# EAGLE design cicely_B_v1 (EAGLE 9.6.2)

## Sheet 1 of 4: Power
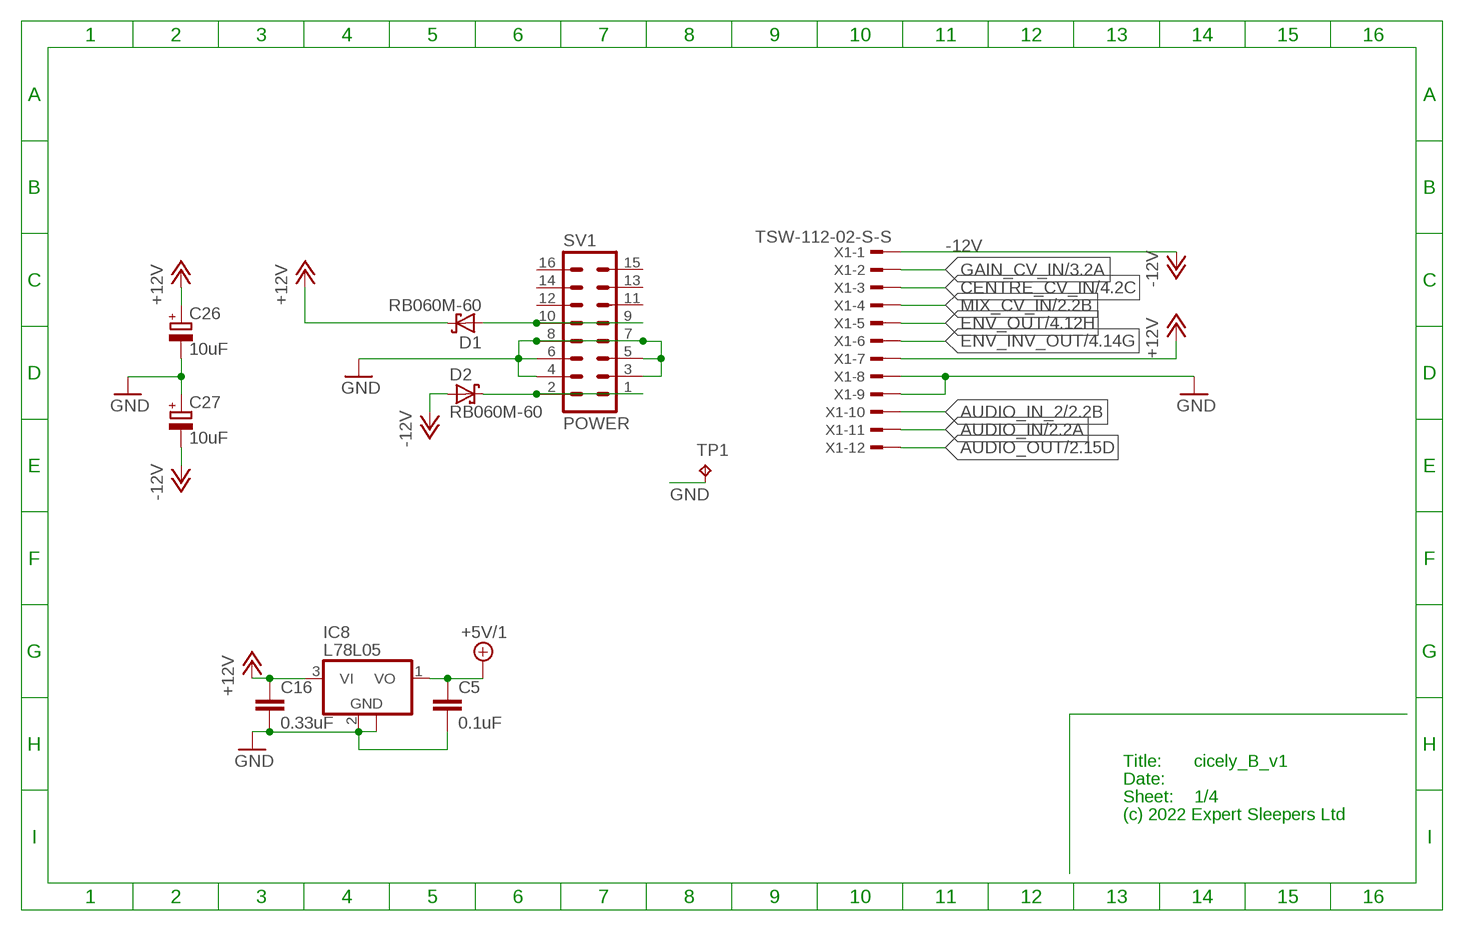
[diagram p0: schematic, sheet 1]

### Parts
C5  0.1uF  C-EUC0402  [C0402]
C16  0.33uF  C-EUC0805  [C0805]
C26  10uF  CPOL-EUUD-4X5,8  [UD-4X5,8_NICHICON]
C27  10uF  CPOL-EUUD-4X5,8  [UD-4X5,8_NICHICON]
D1  RB060M-60  [SOD123FL]
D2  RB060M-60  [SOD123FL]
IC8  L78L05  78L05F  [SOT89]
SV1  POWER  ML16  [ML16]
TP1  RA2  TPPAD1-13  [P1-13]
X1  TSW-112-02-S-S  [TSW-112-02-S-S]

### Nets
+5V/1: C5.1 IC8.1(VO) ; also sheet 2,3
+12V: C16.1 C26.+ D1.C IC8.3(VI) X1.7 ; also sheet 2,3,4
-12V: C27.- D2.A X1.1 ; also sheet 2,3,4
AUDIO_IN: X1.11 ; also sheet 2
AUDIO_IN_2: X1.10 ; also sheet 2
AUDIO_OUT: X1.12 ; also sheet 2
CENTRE_CV_IN: X1.3 ; also sheet 4
ENV_INV_OUT: X1.6 ; also sheet 4
ENV_OUT: X1.5 ; also sheet 4
GAIN_CV_IN: X1.2 ; also sheet 3
GND [power]: C5.2 C16.2 C26.- C27.+ IC8.2(GND) IC8.2@1(GND) SV1.3 SV1.4 SV1.5 SV1.6 SV1.7 SV1.8 TP1.TP X1.8 X1.9 ; also sheet 2,3,4
MIX_CV_IN: X1.4 ; also sheet 2
N$1: D2.C SV1.1 SV1.2
N$15: D1.A SV1.9 SV1.10
Unconnected: SV1.11 SV1.12 SV1.13 SV1.14 SV1.15 SV1.16

### Notes on the sheet
- Title:
- Date:
- Sheet:
- (c) 2022 Expert Sleepers Ltd

## Sheet 2 of 4: Mixer
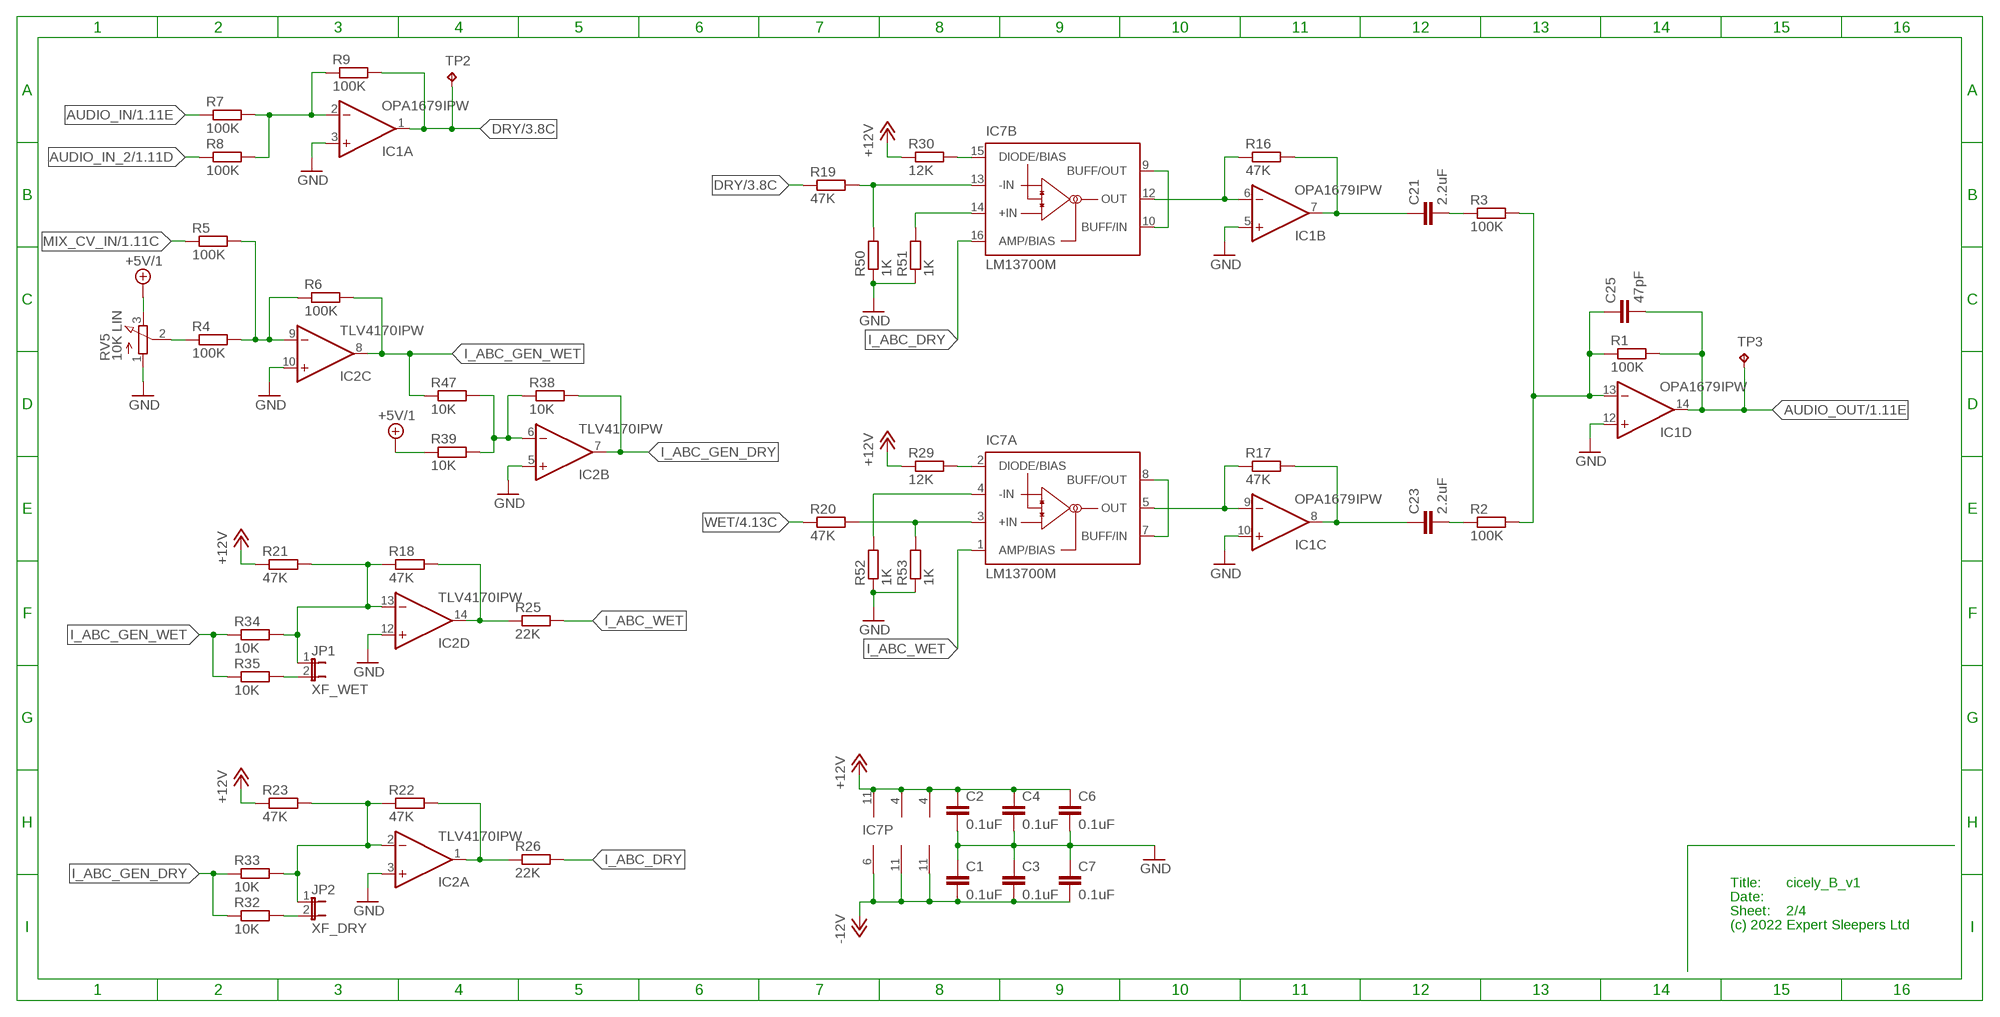
[diagram p1: schematic, sheet 2]

### Parts
C1  0.1uF  C-EUC0402  [C0402]
C2  0.1uF  C-EUC0402  [C0402]
C3  0.1uF  C-EUC0402  [C0402]
C4  0.1uF  C-EUC0402  [C0402]
C6  0.1uF  C-EUC0402  [C0402]
C7  0.1uF  C-EUC0402  [C0402]
C21  2.2uF  C-EUC0805  [C0805]
C23  2.2uF  C-EUC0805  [C0805]
C25  47pF  C-EUC0603  [C0603]
IC1  OPA1679IPW  TL074PW  [PW_R-PDSO-G14]
IC2  TLV4170IPW  TL074PW  [PW_R-PDSO-G14]
IC7  LM13700M  [SO16]
JP1  XF_WET  JP1E  [JP1]
JP2  XF_DRY  JP1E  [JP1]
R1  100K  R-EU_R0603  [R0603]
R2  100K  R-EU_R0603  [R0603]
R3  100K  R-EU_R0603  [R0603]
R4  100K  R-EU_R0603  [R0603]
R5  100K  R-EU_R0603  [R0603]
R6  100K  R-EU_R0603  [R0603]
R7  100K  R-EU_R0603  [R0603]
R8  100K  R-EU_R0603  [R0603]
R9  100K  R-EU_R0603  [R0603]
R16  47K  R-EU_R0603  [R0603]
R17  47K  R-EU_R0603  [R0603]
R18  47K  R-EU_R0603  [R0603]
R19  47K  R-EU_R0603  [R0603]
R20  47K  R-EU_R0603  [R0603]
R21  47K  R-EU_R0603  [R0603]
R22  47K  R-EU_R0603  [R0603]
R23  47K  R-EU_R0603  [R0603]
R25  22K  R-EU_R0603  [R0603]
R26  22K  R-EU_R0603  [R0603]
R29  12K  R-EU_R0603  [R0603]
R30  12K  R-EU_R0603  [R0603]
R32  10K  R-EU_R0603  [R0603]
R33  10K  R-EU_R0603  [R0603]
R34  10K  R-EU_R0603  [R0603]
R35  10K  R-EU_R0603  [R0603]
R38  10K  R-EU_R0603  [R0603]
R39  10K  R-EU_R0603  [R0603]
R47  10K  R-EU_R0603  [R0603]
R50  1K  R-EU_R0603  [R0603]
R51  1K  R-EU_R0603  [R0603]
R52  1K  R-EU_R0603  [R0603]
R53  1K  R-EU_R0603  [R0603]
RV5  10K LIN  RD1610NOA0X  [RD1610NOA0X]
TP2  RA2  TPPAD1-13  [P1-13]
TP3  RA2  TPPAD1-13  [P1-13]

### Nets
+5V/1: R39.1 RV5.3(E) ; also sheet 1,3
+12V: C2.1 C4.1 C6.1 IC1.4(P:V+) IC2.4(P:V+) IC7.11(P:V+) R21.1 R23.1 R29.1 R30.1 ; also sheet 1,3,4
-12V: C1.2 C3.2 C7.2 IC1.11(P:V-) IC2.11(P:V-) IC7.6(P:V-) ; also sheet 1,3,4
AUDIO_IN: R7.1 ; also sheet 1
AUDIO_IN_2: R8.1 ; also sheet 1
AUDIO_OUT: C25.2 IC1.14(D:OUT) R1.2 TP3.TP ; also sheet 1
DRY: IC1.1(A:OUT) R9.2 R19.1 TP2.TP ; also sheet 3,4
GND [power]: C1.1 C2.2 C3.1 C4.2 C6.2 C7.1 IC1.3(A:+IN) IC1.5(B:+IN) IC1.10(C:+IN) IC1.12(D:+IN) IC2.3(A:+IN) IC2.5(B:+IN) IC2.10(C:+IN) IC2.12(D:+IN) R50.1 R51.1 R52.1 R53.1 RV5.1(A) ; also sheet 1,3,4
I_ABC_DRY: IC7.16(B:AMP/BIAS) R26.2
I_ABC_GEN_DRY: IC2.7(B:OUT) R32.1 R33.1 R38.2
I_ABC_GEN_WET: IC2.8(C:OUT) R6.2 R34.1 R35.1 R47.1
I_ABC_WET: IC7.1(A:AMP/BIAS) R25.2
MIX_CV_IN: R5.1 ; also sheet 1
N$2: C25.1 IC1.13(D:-IN) R1.1 R2.2 R3.2
N$7: R4.1 RV5.2(S)
N$9: IC7.15(B:DIODE/BIAS) R30.2
N$10: IC1.9(C:-IN) IC7.5(A:OUT) R17.1
N$12: IC7.2(A:DIODE/BIAS) R29.2
N$13: IC1.6(B:-IN) IC7.12(B:OUT) R16.1
N$14: C23.1 IC1.8(C:OUT) R17.2
N$18: IC2.9(C:-IN) R4.2 R5.2 R6.1
N$20: C21.1 IC1.7(B:OUT) R16.2
N$23: IC7.3(A:+IN) R20.2 R53.2
N$24: IC7.4(A:-IN) R52.2
N$26: IC2.13(D:-IN) JP1.1 R18.1 R21.2 R34.2
N$27: IC2.6(B:-IN) R38.1 R39.2 R47.2
N$28: IC2.14(D:OUT) R18.2 R25.1
N$31: IC2.1(A:OUT) R22.2 R26.1
N$32: IC2.2(A:-IN) JP2.1 R22.1 R23.2 R33.2
N$33: IC7.14(B:+IN) R51.2
N$34: IC7.13(B:-IN) R19.2 R50.2
N$36: C21.2 R3.1
N$38: C23.2 R2.1
N$39: IC7.9(B:BUFF/OUT) IC7.10(B:BUFF/IN)
N$43: IC7.7(A:BUFF/IN) IC7.8(A:BUFF/OUT)
N$44: IC1.2(A:-IN) R7.2 R8.2 R9.1
N$68: JP2.2 R32.2
N$77: JP1.2 R35.2
WET: R20.1 ; also sheet 4

### Notes on the sheet
- Title:
- Date:
- Sheet:
- (c) 2022 Expert Sleepers Ltd

## Sheet 3 of 4: Gain
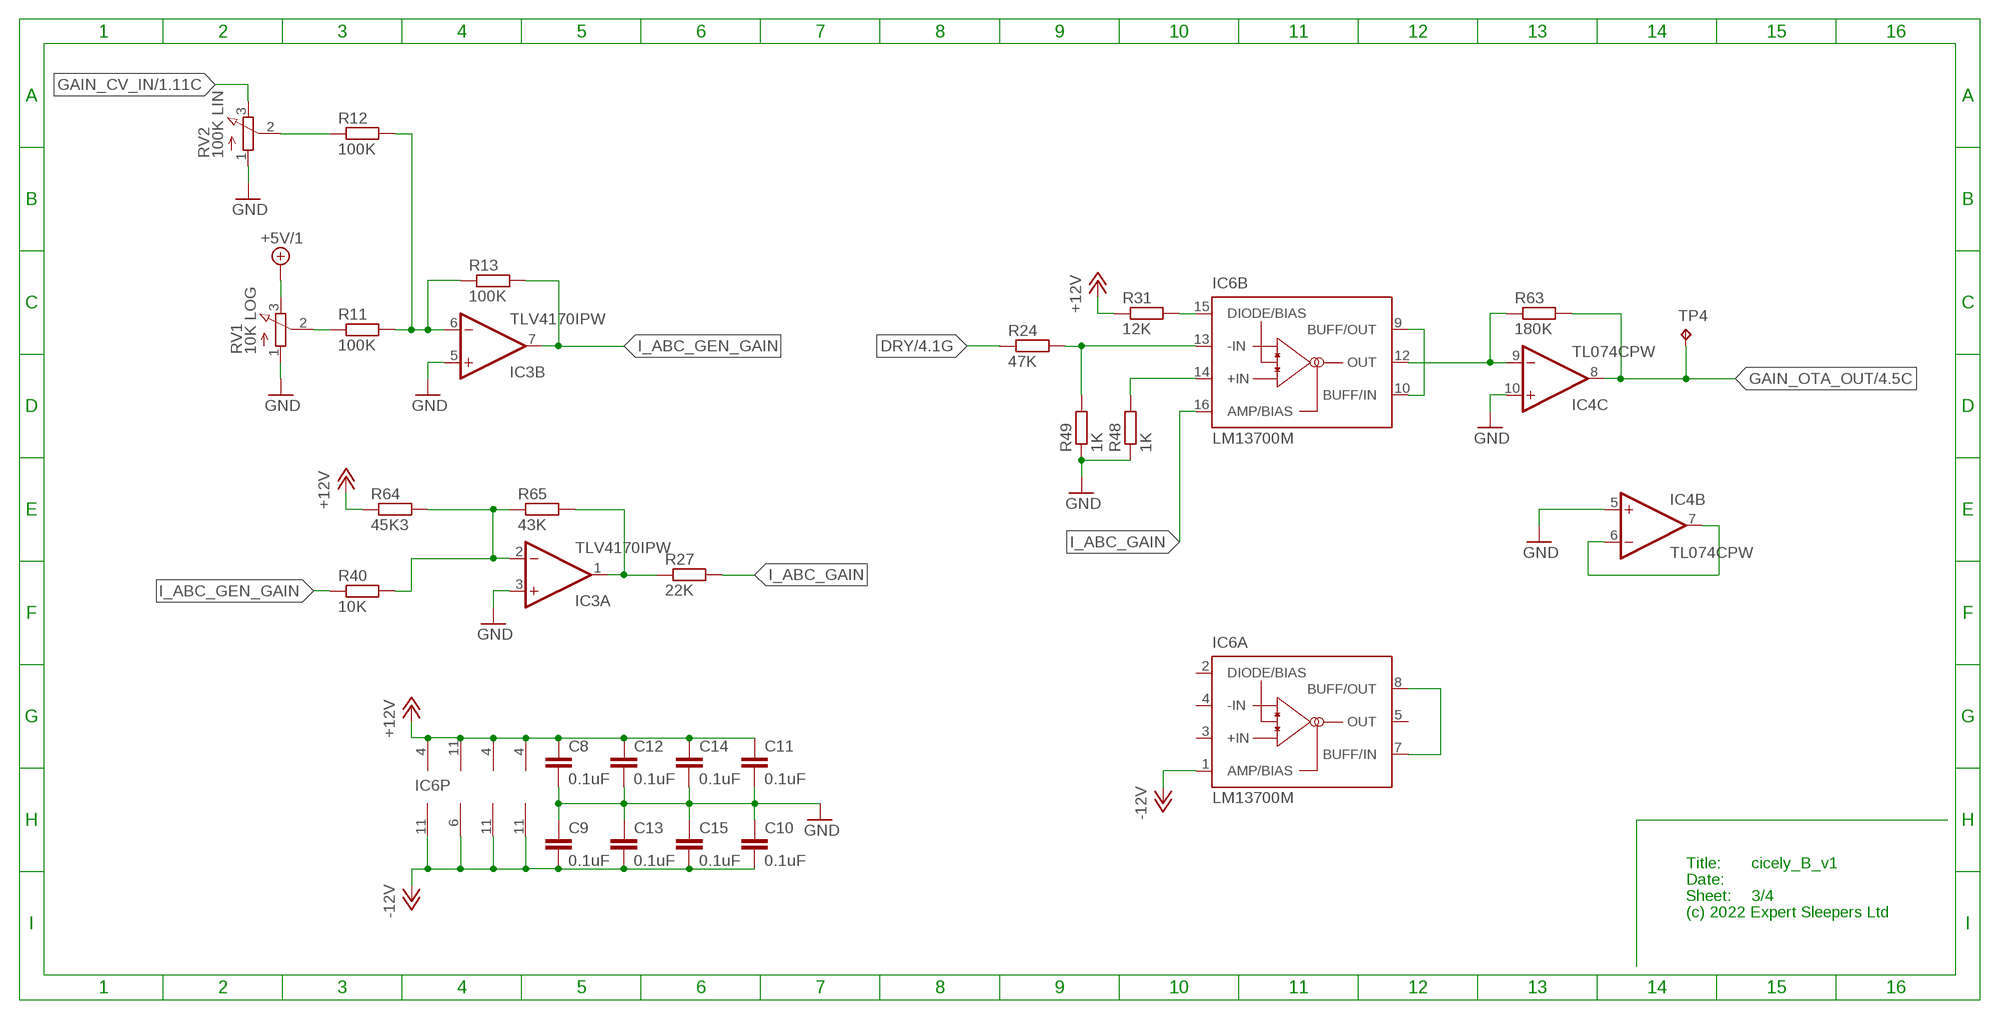
[diagram p2: schematic, sheet 3]

### Parts
C8  0.1uF  C-EUC0402  [C0402]
C9  0.1uF  C-EUC0402  [C0402]
C10  0.1uF  C-EUC0402  [C0402]
C11  0.1uF  C-EUC0402  [C0402]
C12  0.1uF  C-EUC0402  [C0402]
C13  0.1uF  C-EUC0402  [C0402]
C14  0.1uF  C-EUC0402  [C0402]
C15  0.1uF  C-EUC0402  [C0402]
IC3  TLV4170IPW  TL074PW  [PW_R-PDSO-G14]
IC4  TL074CPW  TL074PW  [PW_R-PDSO-G14]
IC5  TL074CPW  TL074PW  [PW_R-PDSO-G14]
IC6  LM13700M  [SO16]
R11  100K  R-EU_R0603  [R0603]
R12  100K  R-EU_R0603  [R0603]
R13  100K  R-EU_R0603  [R0603]
R24  47K  R-EU_R0603  [R0603]
R27  22K  R-EU_R0603  [R0603]
R31  12K  R-EU_R0603  [R0603]
R40  10K  R-EU_R0603  [R0603]
R48  1K  R-EU_R0603  [R0603]
R49  1K  R-EU_R0603  [R0603]
R63  180K  R-EU_R0603  [R0603]
R64  45K3  R-EU_R0603  [R0603]
R65  43K  R-EU_R0603  [R0603]
RV1  10K LOG  RD1610NOA0X  [RD1610NOA0X]
RV2  100K LIN  RD1610NOA0X  [RD1610NOA0X]
TP4  RA2  TPPAD1-13  [P1-13]

### Nets
+5V/1: RV1.3(E) ; also sheet 1,2
+12V: C8.1 C11.1 C12.1 C14.1 IC3.4(P:V+) IC4.4(P:V+) IC5.4(P:V+) IC6.11(P:V+) R31.1 R64.1 ; also sheet 1,2,4
-12V: C9.2 C10.2 C13.2 C15.2 IC3.11(P:V-) IC4.11(P:V-) IC5.11(P:V-) IC6.1(A:AMP/BIAS) IC6.6(P:V-) ; also sheet 1,2,4
DRY: R24.1 ; also sheet 2,4
GAIN_CV_IN: RV2.3(E) ; also sheet 1
GAIN_OTA_OUT: IC4.8(C:OUT) R63.2 TP4.TP ; also sheet 4
GND [power]: C8.2 C9.1 C10.1 C11.2 C12.2 C13.1 C14.2 C15.1 IC3.3(A:+IN) IC3.5(B:+IN) IC4.5(B:+IN) IC4.10(C:+IN) R48.1 R49.1 RV1.1(A) RV2.1(A) ; also sheet 1,2,4
I_ABC_GAIN: IC6.16(B:AMP/BIAS) R27.2
I_ABC_GEN_GAIN: IC3.7(B:OUT) R13.2 R40.1
N$8: IC6.9(B:BUFF/OUT) IC6.10(B:BUFF/IN)
N$35: IC6.7(A:BUFF/IN) IC6.8(A:BUFF/OUT)
N$37: IC6.15(B:DIODE/BIAS) R31.2
N$40: IC4.9(C:-IN) IC6.12(B:OUT) R63.1
N$41: IC4.6(B:-IN) IC4.7(B:OUT)
N$46: IC6.14(B:+IN) R48.2
N$48: IC6.13(B:-IN) R24.2 R49.2
N$50: R11.1 RV1.2(S)
N$51: IC3.6(B:-IN) R11.2 R12.2 R13.1
N$52: IC3.2(A:-IN) R40.2 R64.2 R65.1
N$53: IC3.1(A:OUT) R27.1 R65.2
N$87: R12.1 RV2.2(S)
Unconnected: IC6.2(A:DIODE/BIAS) IC6.3(A:+IN) IC6.4(A:-IN) IC6.5(A:OUT)

### Notes on the sheet
- Title:
- Date:
- Sheet:
- (c) 2022 Expert Sleepers Ltd

## Sheet 4 of 4: Core
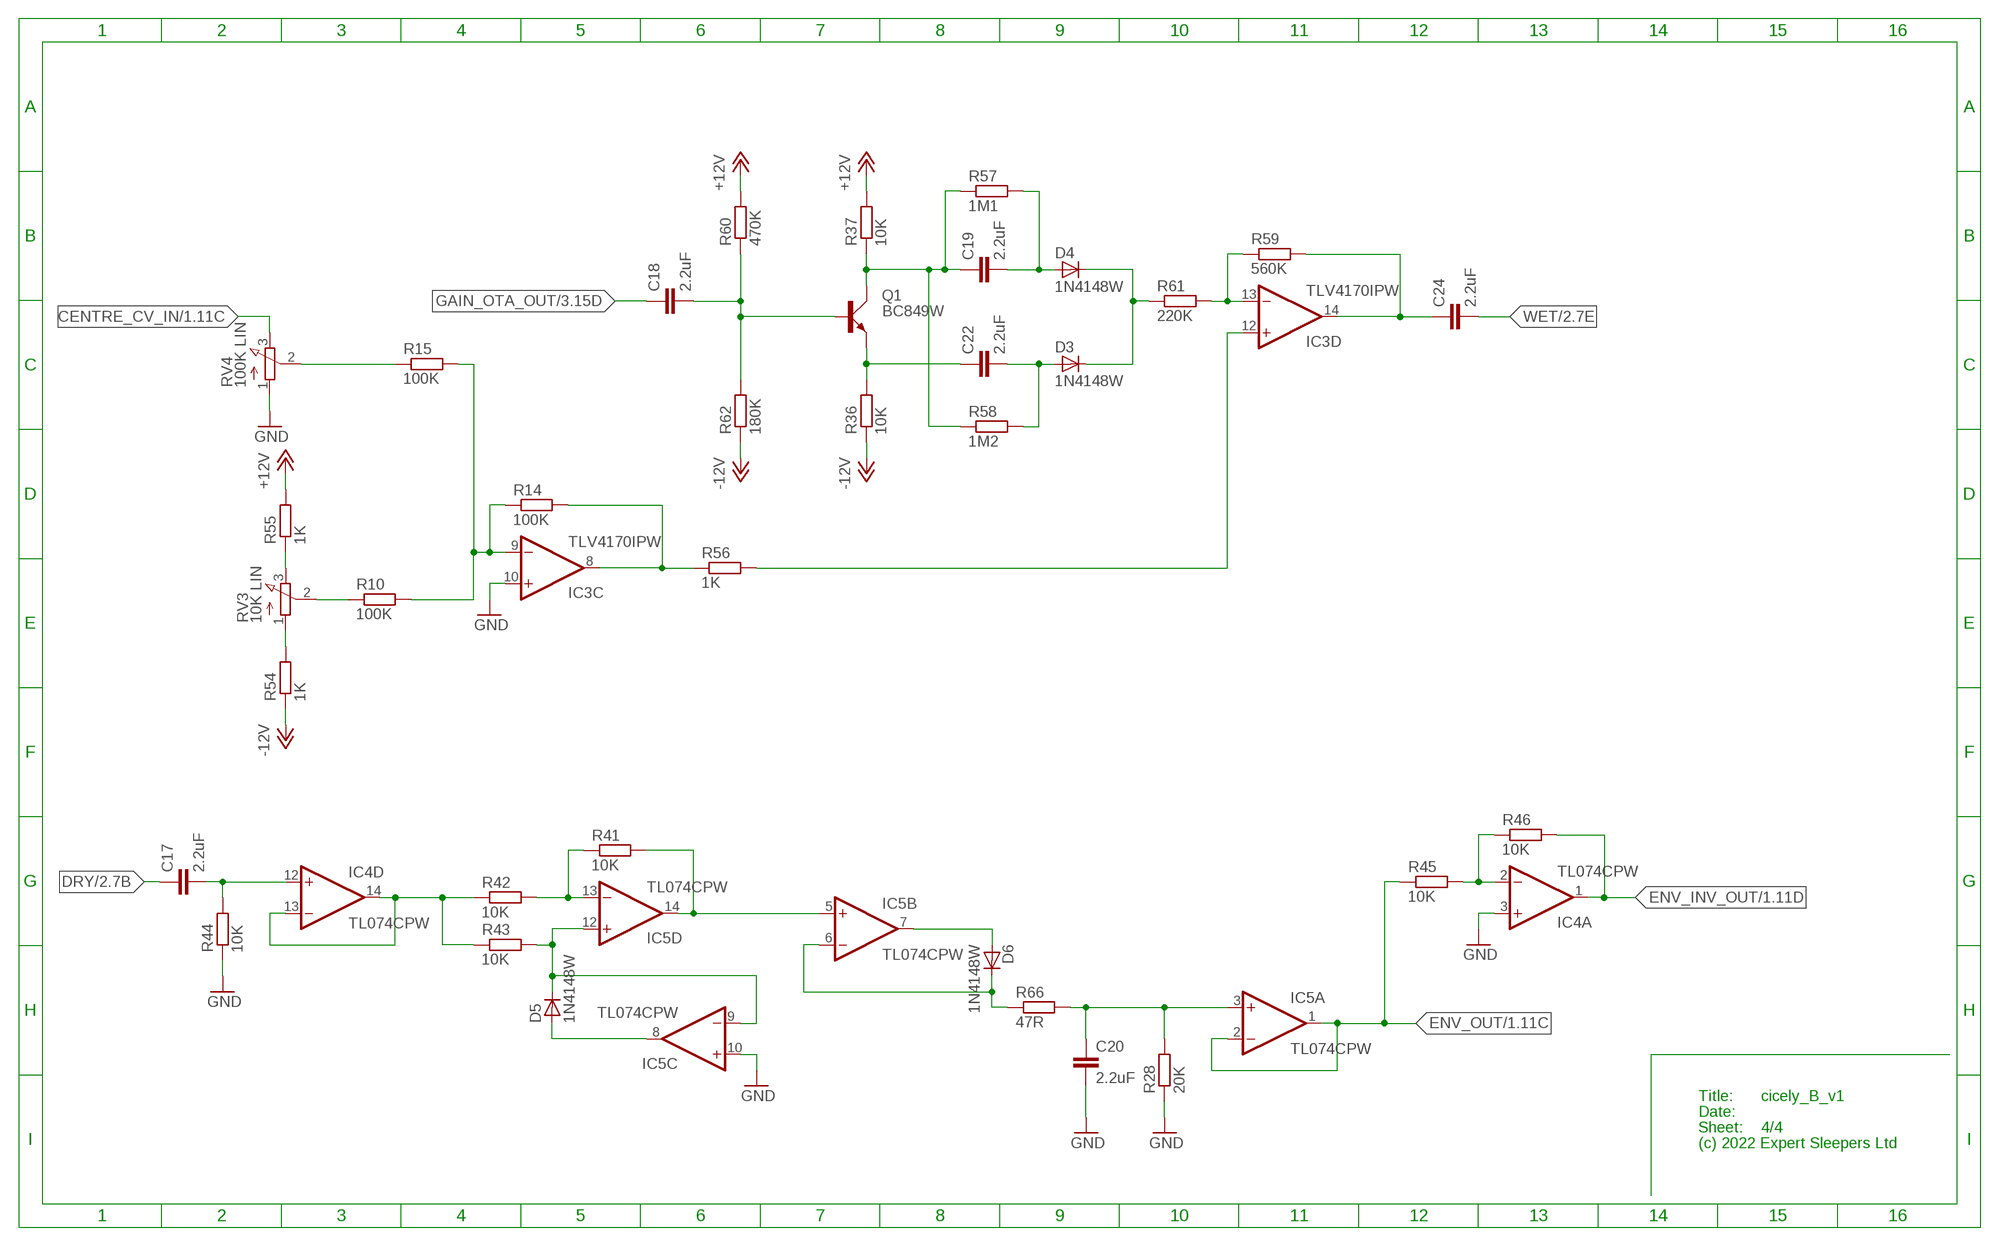
[diagram p3: schematic, sheet 4]

### Parts
C17  2.2uF  C-EUC0805  [C0805]
C18  2.2uF  C-EUC0805  [C0805]
C19  2.2uF  C-EUC0805  [C0805]
C20  2.2uF  C-EUC0805  [C0805]
C22  2.2uF  C-EUC0805  [C0805]
C24  2.2uF  C-EUC0805  [C0805]
D3  1N4148W  [SOD123]
D4  1N4148W  [SOD123]
D5  1N4148W  [SOD123]
D6  1N4148W  [SOD123]
Q1  BC849W  [SOT323]
R10  100K  R-EU_R0603  [R0603]
R14  100K  R-EU_R0603  [R0603]
R15  100K  R-EU_R0603  [R0603]
R28  20K  R-EU_R0603  [R0603]
R36  10K  R-EU_R0603  [R0603]
R37  10K  R-EU_R0603  [R0603]
R41  10K  R-EU_R0603  [R0603]
R42  10K  R-EU_R0603  [R0603]
R43  10K  R-EU_R0603  [R0603]
R44  10K  R-EU_R0603  [R0603]
R45  10K  R-EU_R0603  [R0603]
R46  10K  R-EU_R0603  [R0603]
R54  1K  R-EU_R0603  [R0603]
R55  1K  R-EU_R0603  [R0603]
R56  1K  R-EU_R0603  [R0603]
R57  1M1  R-EU_R0603  [R0603]
R58  1M2  R-EU_R0603  [R0603]
R59  560K  R-EU_R0603  [R0603]
R60  470K  R-EU_R0603  [R0603]
R61  220K  R-EU_R0603  [R0603]
R62  180K  R-EU_R0603  [R0603]
R66  47R  R-EU_R0603  [R0603]
RV3  10K LIN  RD1610NOA0X  [RD1610NOA0X]
RV4  100K LIN  RD1610NOA0X  [RD1610NOA0X]

### Nets
+12V: R37.2 R55.2 R60.2 ; also sheet 1,2,3
-12V: R36.1 R54.1 R62.1 ; also sheet 1,2,3
CENTRE_CV_IN: RV4.3(E) ; also sheet 1
DRY: C17.1 ; also sheet 2,3
DRY_AC: IC4.13(D:-IN) IC4.14(D:OUT) R42.1 R43.1
ENV_INV_OUT: IC4.1(A:OUT) R46.2 ; also sheet 1
ENV_OUT: IC5.1(A:OUT) IC5.2(A:-IN) R45.1 ; also sheet 1
GAIN_OTA_OUT: C18.1 ; also sheet 3
GND [power]: C20.2 IC3.10(C:+IN) IC4.3(A:+IN) IC5.10(C:+IN) R28.1 R44.1 RV4.1(A) ; also sheet 1,2,3
N$42: C17.2 IC4.12(D:+IN) R44.2
N$45: R54.2 RV3.1(A)
N$49: R55.1 RV3.3(E)
N$54: IC3.12(D:+IN) R56.2
N$55: IC3.13(D:-IN) R59.1 R61.2
N$56: C24.1 IC3.14(D:OUT) R59.2
N$57: R10.1 RV3.2(S)
N$58: IC3.9(C:-IN) R10.2 R14.1 R15.2
N$59: C18.2 Q1.1(B) R60.1 R62.2
N$60: C19.2 D4.A R57.2
N$61: C22.2 D3.A R58.2
N$64: C19.1 Q1.3(C) R37.1 R57.1 R58.1
N$67: C22.1 Q1.2(E) R36.2
N$69: D3.C D4.C R61.1
N$70: IC5.13(D:-IN) R41.1 R42.2
N$73: D6.C IC5.6(B:-IN) R66.1
N$75: IC5.5(B:+IN) IC5.14(D:OUT) R41.2
N$82: D5.C IC5.9(C:-IN) IC5.12(D:+IN) R43.2
N$83: D5.A IC5.8(C:OUT)
N$84: C20.1 IC5.3(A:+IN) R28.2 R66.2
N$85: D6.A IC5.7(B:OUT)
N$86: IC4.2(A:-IN) R45.2 R46.1
N$88: R15.1 RV4.2(S)
VAC_B_CV: IC3.8(C:OUT) R14.2 R56.1
WET: C24.2 ; also sheet 2

### Notes on the sheet
- Title:
- Date:
- Sheet:
- (c) 2022 Expert Sleepers Ltd

## Library data of the parts
C1-C25 = rcl:C-EU: CAPACITOR, European symbol
C26 C27 = rcl:CPOL-EU: POLARIZED CAPACITOR, European symbol
D1 D2 = rohm2:RB060M-60: Schottky Barrier Diode
D3-D6 = diodes:1N4148W
IC1-IC5 = digital-audio:TL074: OP AMP
IC6 IC7 = texas:LM13700: Dual Operational Transconductance Amplifiers with Linearizing Diodes and Buffers Source: lm13700.PDF
IC8 = linear:78L*: POSITOIV-VOLTAGE REGULATORS Output up to 100 mA Source: http://focus.ti.com/lit/ds/symlink/ua78l05.pdf
JP1 JP2 = jumper:JP1E: JUMPER
Q1 = NXP:BC849W
R1-R66 = rcl:R-EU_: RESISTOR, European symbol
RV1-RV5 = soundwell:RD1610NOA0X: 16mm Potentiometer one level Source: http://www.alphapotentiometers.net/html/16mm_pot_2.html
SV1 = digital-audio:ML16: MULTICOMP - MC9A12-1634
TP1-TP4 = testpad:TP: Test pad
X1 = con-samtec:TSW-112-02-S-S: THROUGH-HOLE .025" SQ POST HEADER Source: Samtec TSW.pdf; OC_FARNELL: unknown; OC_NEWARK: unknown

## Board
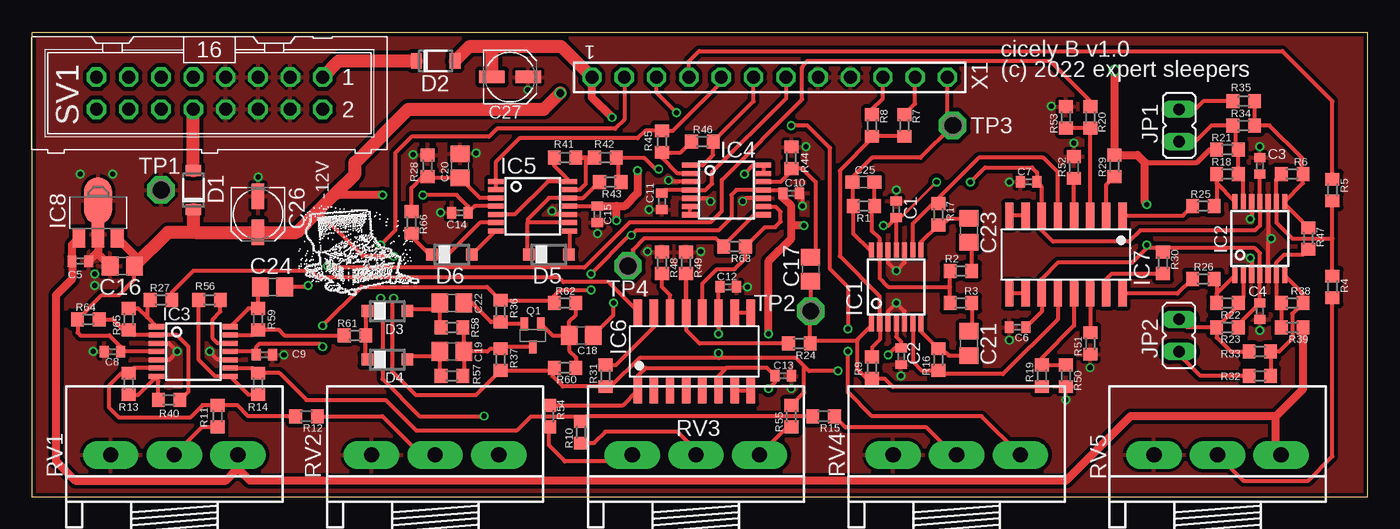
[diagram p4: board, top side]
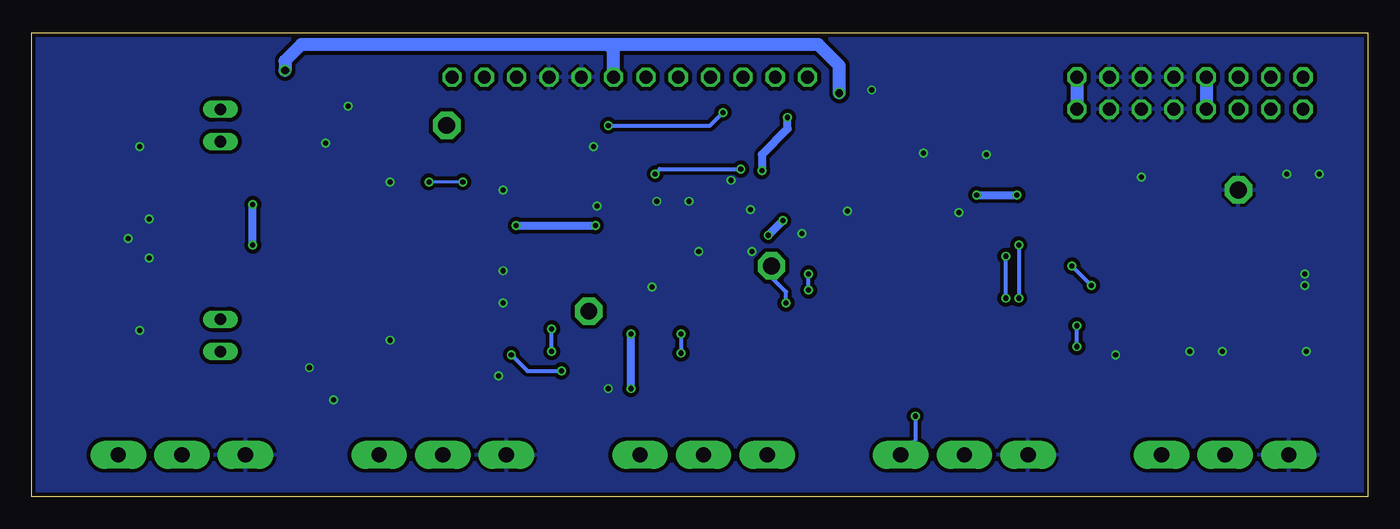
[diagram p5: board, bottom side, seen from below]

Size 105 x 36.5 mm. Coordinates in mm from the lower left corner, seen from the top.
Outline: 0,0 105,0 105,36.5 0,36.5 0,0
Copper layers (1*16): Top 0.035mm / dielectric 1.5mm / Bottom 0.035mm
Design rules "pcbtrain *": minimum track width 0.125mm, minimum drill 0.3mm, track to track 0.125mm, track to pad 0.125mm, pad to pad 0.125mm, via to via 0.125mm, smd to smd 0.125mm, copper to edge 0.25mm, drill to drill 8mil, minimum pad ring 0.15mm, minimum via ring 0.15mm, stop-mask expansion 4mil, vias tented up to drill 0mil, thermal gap 10mil

### Footprints (pad centres in the part's own frame; a part is rotated, then mirrored left to right if it is on the bottom)
C0402 = smd 0.7 x 0.9: 1 -0.65,0; 2 0.65,0
C0805 = smd 1.3 x 1.5: 1 -0.95,0; 2 0.95,0
C0603 = smd 1.1 x 1: 1 -0.85,0; 2 0.85,0
UD-4X5,8_NICHICON = smd 2 x 1: + 1.425,0; - -1.425,0
SOD123FL = smd 0.85 x 1.2: A 1.525,0; C -1.525,0
SOD123 = smd 0.9 x 0.95: A 1.575,0; C -1.575,0
PW_R-PDSO-G14 = smd 0.4 x 1.2: 1 -1.95,-2.9; 2 -1.3,-2.9; 3 -0.65,-2.9; 4 0,-2.9; 5 0.65,-2.9; 6 1.3,-2.9; 7 1.95,-2.9; 8 1.95,2.9; 9 1.3,2.9; 10 0.65,2.9; 11 0,2.9; 12 -0.65,2.9; 13 -1.3,2.9; 14 -1.95,2.9
SO16 = smd 0.66 x 2.032: 1 -4.445,-3.073; 2 -3.175,-3.073; 3 -1.905,-3.073; 4 -0.635,-3.073; 5 0.635,-3.073; 6 1.905,-3.073; 7 3.175,-3.073; 8 4.445,-3.073; 9 4.445,3.073; 10 3.175,3.073; 11 1.905,3.073; 12 0.635,3.073; 13 -0.635,3.073; 14 -1.905,3.073; 15 -3.175,3.073; 16 -4.445,3.073
SOT89 = smd 1 x 1.5: 1 -1.499,-1.981; 3 1.499,-1.981 | smd 1 x 2: 2 0,-1.727 | smd 2.2 x 3.7: 2@1 0,0.94
JP1 = drill 0.914 long: 1 0,-1.27; 2 0,1.27
SOT323 = smd 0.6 x 1: 1 -0.65,-0.9; 2 0.65,-0.9; 3 0,0.9
R0603 = smd 1 x 1.1: 1 -0.85,0; 2 0.85,0
RD1610NOA0X = drill 1.2 pad 2.184 long: 1 -5,3.8; 2 0,3.8; 3 5,3.8
ML16 = drill 1.016 octagon: 1 -8.89,-1.27; 2 -8.89,1.27; 3 -6.35,-1.27; 4 -6.35,1.27; 5 -3.81,-1.27; 6 -3.81,1.27; 7 -1.27,-1.27; 8 -1.27,1.27; 9 1.27,-1.27; 10 1.27,1.27; 11 3.81,-1.27; 12 3.81,1.27; 13 6.35,-1.27; 14 6.35,1.27; 15 8.89,-1.27; 16 8.89,1.27
P1-13 = drill 1.321 pad 2.159 octagon: TP 0,0
TSW-112-02-S-S = drill 1 pad 1.5 octagon: 1 13.97,0; 2 11.43,0; 3 8.89,0; 4 6.35,0; 5 3.81,0; 6 1.27,0; 7 -1.27,0; 8 -3.81,0; 9 -6.35,0; 10 -8.89,0; 11 -11.43,0; 12 -13.97,0

### Placement (x,y rotation side)
C1  67.94,22.61 270 top
C2  68.33,11.05 270 top
C3  96.52,26.04 270 top
C4  96.52,14.61 270 top
C5  3.81,18.54 0 top
C6  77.47,13.34 180 top
C7  78.36,24.77 0 top
C8  6.35,11.43 180 top
C9  18.29,11.18 180 top
C10  59.69,23.88 180 top
C11  49.53,23.24 270 top
C12  54.74,16.51 0 top
C13  59.05,9.53 180 top
C14  33.66,22.35 180 top
C15  44.45,22.23 90 top
C16  7.11,18.16 180 top
C17  61.21,17.91 90 top
C18  43.18,12.7 180 top
C19  33.02,11.43 180 top
C20  33.66,26.04 90 top
C21  73.66,12.06 90 top
C22  33.02,15.24 180 top
C23  73.66,20.95 270 top
C24  18.92,16.51 0 top
C25  65.37,24.77 180 top
C26  17.78,22.23 270 top
C27  37.59,33.02 0 top
D1  12.7,24.13 90 top
D2  31.75,34.29 0 top
D3  27.94,14.61 0 top
D4  27.94,10.79 0 top
D5  40.64,19.05 0 top
D6  33.02,19.05 0 top
IC1  67.94,16.51 0 top
IC2  96.52,20.32 0 top
IC3  12.7,11.43 270 top
IC4  54.61,24.13 270 top
IC5  39.37,22.86 270 top
IC6  52.07,11.43 0 top
IC7  81.28,19.05 180 top
IC8  5.21,22.35 0 top
JP1  90.17,29.21 0 top
JP2  90.17,12.7 180 top
Q1  39.37,12.7 180 top
R1  65.41,22.86 180 top
R2  73.03,17.78 180 top
R3  73.03,15.24 180 top
R4  102.23,16.51 90 top
R5  102.23,24.13 270 top
R6  99.06,25.4 0 top
R7  68.58,29.21 270 top
R8  66.04,29.21 270 top
R9  66.04,10.16 270 top
R10  43.18,5.08 90 top
R11  14.61,6.35 90 top
R12  21.59,6.35 180 top
R13  7.62,8.89 270 top
R14  17.78,8.89 270 top
R15  62.23,6.35 180 top
R16  71.25,10.79 90 top
R17  71.25,22.23 270 top
R18  93.98,25.4 180 top
R19  79.38,9.53 90 top
R20  83.19,29.84 270 top
R21  93.98,27.3 0 top
R22  93.98,15.24 180 top
R23  93.98,13.34 180 top
R24  60.33,12.06 180 top
R25  92.08,22.86 180 top
R26  92.08,17.14 180 top
R27  10.16,15.49 0 top
R28  31.11,26.04 270 top
R29  85.09,26.04 270 top
R30  88.9,18.41 270 top
R31  45.09,9.53 90 top
R32  96.52,9.53 180 top
R33  96.52,11.43 180 top
R34  95.25,29.21 180 top
R35  95.25,31.11 180 top
R36  36.83,14.61 270 top
R37  36.83,10.79 270 top
R38  99.06,15.24 0 top
R39  99.06,13.34 180 top
R40  10.79,7.62 0 top
R41  41.91,26.67 180 top
R42  45.09,26.67 180 top
R43  45.47,24.77 180 top
R44  59.69,26.67 270 top
R45  49.53,27.94 270 top
R46  52.7,27.94 0 top
R47  100.33,20.32 270 top
R48  49.53,18.41 270 top
R49  51.44,18.41 270 top
R50  81.28,9.53 90 top
R51  83.19,12.06 90 top
R52  81.92,25.91 270 top
R53  81.28,29.84 270 top
R54  40.64,6.35 270 top
R55  59.69,6.35 90 top
R56  13.97,15.49 0 top
R57  33.02,9.53 180 top
R58  33.02,13.34 180 top
R59  17.78,13.97 90 top
R60  41.91,10.16 180 top
R61  25.4,12.7 180 top
R62  41.91,15.24 0 top
R63  55.24,19.68 180 top
R64  4.45,13.97 0 top
R65  7.62,13.97 90 top
R66  29.84,21.59 90 top
RV1  11.2,-0.5 0 top
RV2  31.7,-0.5 0 top
RV3  52.2,-0.5 0 top
RV4  72.7,-0.5 0 top
RV5  93.2,-0.5 0 top
SV1  13.97,31.75 180 top
TP1  10.16,24.13 0 top
TP2  61.21,14.61 0 top
TP3  72.39,29.21 0 top
TP4  46.86,18.16 0 top
U$2  [TREASURE_10MM_300DPI]  20.59,15.77 0 top
X1  58,33 180 top

### Tracks (layer width: path | path; a pad name or v marks a point on that pad's centre or on a via)
+5V/1
  Top 0.61: IC8.1 3.16,19.82 C5.1 3.16,17.13 1.91,15.88 1.91,2.79 3.43,1.27 15.24,1.27 16.2,2.23 | R39.1 99.91,8.47 97.79,6.35 | 16.2,2.23 RV1.3 | 97.79,6.35 86.36,6.35 81.28,1.27 17.16,1.27 16.2,2.23 | RV5.3 97.79,3.71 97.79,6.35
+12V  (via drill 0.4, 0.6)
  Top 0.254: 87.63,19.56 v87.63,19.81
  Top 0.305: R23.1 94.83,13.56 C4.1 IC2.4 96.52,19.18 96.14,19.56 88.9,19.56 | 40.91,10.01 40.84,9.95 R37.2 34.89,8 30.21,8 28.32,9.89 28.32,15.49 v28.45,15.62 | 40.91,10.01 R60.2 | IC5.4 34.81,22.86 C14.1 34.3,22.84 33.4,23.75 v30.73,23.75 | C6.1 79.38,14.59 IC7.11 79.38,17.14 80.64,18.41 86.49,18.41 87.63,19.56 88.9,19.56 | 40.91,10.01 40.91,9.51 41.74,8.68 R31.1 45.51,8.68 47.75,10.92 53.98,10.92 | C12.1 53.98,16.4 IC6.11 v53.98,12.83 | C16.1 8.06,17.08 6.86,15.88 5.5,15.88 R64.1 3.6,12.91 3.81,12.7 6.1,12.7 7,11.8 C8.1 IC3.4 | R30.1 88.9,19.56 | C11.1 49.77,24.13 IC4.4 52.96,24.13 53.47,24.64 53.47,25.53 59.31,31.37 59.31,32.96 X1.7 | 23.88,23.75 23.81,23.81 | v28.45,18.92 26.04,18.92 22.48,22.48 | R55.2 60.71,8.22 60.71,10.29 | 53.98,10.92 60.07,10.92 60.71,10.29 | v53.98,11.3 53.98,10.92 | v67.31,11.18 67.83,11.7 C2.1 68.33,12.21 67.94,12.59 IC1.4 | v63.37,9.91 61.09,9.91 60.71,10.29
  Top 0.406: R21.1 92.58,27.3 91.57,26.29 87.5,26.29
  Top 0.61: C16.1 8.06,19.02 IC8.3 | v85.09,33.53 R29.1 86.91,26.89 87.5,26.29 87.5,23.11 v87.63,22.99 | v27.56,23.75 23.88,23.75
  Top 1.016: D1.C 12.7,20.95 12.85,20.8 | 12.85,20.8 C26.+ 20.8,20.8 22.48,22.48 23.81,23.81 25.4,25.4 25.4,26.29 29.59,30.48 40.26,30.48 v41.53,31.75 | 12.85,20.8 10.7,20.8 C16.1
  Bottom 0.305: v28.45,15.62 v28.45,18.92 | v53.98,12.83 v53.98,11.3 | v67.31,11.18 66.04,9.91 v63.37,9.91
  Bottom 0.61: v87.63,19.81 v87.63,22.99 | v30.73,23.75 v27.56,23.75
  Bottom 1.016: v41.53,31.75 41.53,33.91 43.18,35.56 59.69,35.56 | v85.09,33.53 85.09,34.29 83.82,35.56 59.69,35.56 | X1.7 59.27,35.14 59.69,35.56
-12V  (via drill 0.4)
  Top 0.254: C1.2 68.31,21.96 v71.12,24.77
  Top 0.305: C3.2 IC2.11 96.52,21.34 96.14,20.95 87.12,20.95 86.23,20.07 80.26,20.07 79.38,20.95 IC7.6 79.38,24.4 C7.2 79.01,25.51 78.61,25.91 74.93,25.91 v73.79,24.77 | IC1.11 C1.2 67.33,21.34 v66.93,21.34 | IC3.11 17.38,11.43 C9.2 17.64,11.8 17.91,12.06 22.61,12.06 v22.86,11.81 | IC5.11 42.28,22.88 C15.2 45.97,22.88 | 54.61,10.16 57.77,10.16 C13.2 58.41,9 v57.91,8.51 | 54.61,10.16 53.98,9.53 IC6.6 | 54.61,10.16 48.26,10.16 47.62,9.53 IC6.1 46.47,7.2 R54.1 | 59.04,23.51 C10.2 58.79,24.13 IC4.11 55.37,24.13 54.99,23.75 54.99,21.97 53.98,20.95 47.5,20.95 v47.12,20.57 46.99,20.57 v43.94,17.53 | v43.94,16.26 41.53,16.26 41.06,15.79 R62.1 40.84,15.46 R36.1 35.77,16.51 25.91,16.51 v22.86,13.46
  Top 0.61: v57.91,12.83 57.91,18.54 59.69,20.32 59.69,21.34 | 59.69,21.34 59.69,22.86 59.04,23.51 | v60.71,21.34 59.69,21.34 | v45.97,21.72 45.97,22.88 | C15.2 46.62,22.88 47.62,23.88 v47.62,25.65 | v45.59,29.84 44.03,31.41 X1.1
  Top 1.016: D2.A 34.42,35.43 36.32,35.43 | X1.1 41.6,35.43 36.32,35.43 | C27.- 36.17,35.28 36.32,35.43
  Bottom 0.254: v71.12,24.77 v73.79,24.77
  Bottom 0.305: v43.94,16.26 v43.94,17.53 | v22.86,11.81 v22.86,13.46
  Bottom 0.61: v57.91,8.51 v57.91,12.83 | v66.93,21.34 v60.71,21.34 | v47.12,20.57 v45.97,21.72 | v47.62,25.65 47.62,26.92 45.59,28.96 v45.59,29.84
AUDIO_IN
  Top 0.305: R7.1 69.43,30.91 X1.11
AUDIO_IN_2
  Top 0.305: R8.1 66.04,30.48 66.89,31.33 X1.10
AUDIO_OUT
  Top 0.305: IC1.14 65.87,19.41 64.56,20.72 R1.2 64.56,24.73 C25.2 64.52,25.15 66.04,26.67 69.85,26.67 TP3.TP 71.97,29.63 X1.12
CENTRE_CV_IN  (via drill 0.4)
  Top 0.305: RV4.3 74.65,6.35 66.04,6.35 64.14,8.26 v64.14,11.43 | v64.14,13.21 64.14,16.51 62.74,17.91 62.74,27.43 60.96,29.21 v59.69,29.21 | X1.3 49.11,31.79 v50.67,30.23
  Bottom 0.305: v64.14,11.43 v64.14,13.21 | v59.69,29.21 51.69,29.21 v50.67,30.23
DRY
  Top 0.305: IC1.1 66,13.48 64.9,12.38 64.9,12.32 | 64.9,12.32 64.9,10.03 65.62,9.31 R9.2 67.02,9.31 67.69,8.64 79.34,8.64 R19.1 | 64.9,12.32 61.43,12.32 R24.1 61.17,14.57 TP2.TP C17.1
DRY_AC  (via drill 0.4)
  Top 0.305: IC4.13 IC4.14 56.69,26.08 v56.01,25.4 | R43.1 46.06,25.02 46.06,26.54 R42.1 48.13,26.67 49.02,25.78 v49.28,25.78
  Bottom 0.305: v49.28,25.78 55.63,25.78 v56.01,25.4
ENV_INV_OUT
  Top 0.305: X1.6 56.73,31.11 R46.2 53.55,26.89 52.75,26.08 IC4.1
ENV_OUT
  Top 0.305: IC5.2 IC5.1 36.47,26.31 38.35,28.19 47.62,28.19 48.22,28.79 R45.1 50.38,28.79 54.19,32.6 X1.5
GAIN_CV_IN  (via drill 0.4)
  Top 0.305: X1.2 46.57,29.68 45.85,28.96 36.58,28.96 35.94,28.32 29.84,28.32 28.57,27.05 28.57,20.95 v27.43,19.81 | v27.43,15.62 27.56,15.49 27.56,9.27 30.48,6.35 v35.56,6.35
  Bottom 0.305: v27.43,19.81 v27.43,15.62 | v35.56,6.35 35.56,4.44 RV2.3
GAIN_OTA_OUT  (via drill 0.4)
  Top 0.305: IC4.8 56.76,22.18 54.4,19.81 R63.2 53.76,20.32 48.13,20.32 47.24,19.43 47.24,18.54 TP4.TP | C18.1 45.72,14.29 v45.72,15.24
  Bottom 0.305: v45.72,15.24 45.72,16.13 46.86,17.27 TP4.TP
GND  (via drill 0.4)
  Top 0.305: IC1.3 67.3,14.59 v67.94,15.24 68.59,14.59 IC1.5 | IC1.12 67.3,18.43 v67.94,17.78 68.59,18.43 IC1.10 | IC3.3 10.78,12.08 v11.43,11.43 10.78,10.78 IC3.5 | v95.76,18.8 95.89,18.67 95.89,17.43 IC2.3 | IC2.12 95.89,23.2 95.89,21.97 v95.76,21.84 | IC2.5 97.17,20.08 v97.41,20.32 97.17,20.56 IC2.10 | IC5.10 41.16,22.21 v40.89,22.48 | IC4.10 56.12,23.48 v55.88,23.24 | IC4.3 50.15,24.78 v50.04,24.89 | IC4.5 53.1,23.48 v53.34,23.24 | IC3.10 14.62,10.78 v13.97,11.43 | C10.1 60.58,23.64 v60.58,22.86
  Top 0.61: IC8.2 5.21,19.29 | 5.21,19.29 C5.2 | C16.2 5.21,19.12 5.21,19.29
  other vias: 96.52,13.08 96.52,27.56 76.83,12.32 76.83,24.77 68.33,9.53 67.94,24.13 83.19,10.16 80.14,30.73 4.83,11.43 19.81,11.18 56.26,16.51 59.69,8.51 44.45,20.7 32.13,22.35 81.28,7.62 52.58,19.3 17.78,25.15 38.99,32 4.95,17.53 4.95,16.64 29.97,26.92 34.92,27.05 48.39,19.3 81.92,27.81 60.83,27.56 48.51,22.61 3.81,25.4 6.35,25.4
  pour Top (isolate 0.305): 0,0 105,0 105,36.5 0,36.5
  pour Bottom (isolate 0.305): 0,0 105,0 105,36.5 0,36.5
I_ABC_DRY
  Top 0.305: R26.2 90.06,15.98 IC7.16
I_ABC_GAIN
  Top 0.305: IC6.16 47.62,14.61 45.34,16.89 41.78,16.89 41.4,17.27 22.48,17.27 21.97,17.78 12.7,17.78 11.01,16.09 R27.2
I_ABC_GEN_DRY
  Top 0.305: IC2.7 99.91,15.98 R38.2 99.06,14.39 99.06,12.45 98.04,11.43 R33.1 R32.1
I_ABC_GEN_GAIN
  Top 0.305: R13.2 8.36,8.04 9.69,9.37 | 9.69,9.37 IC3.7 | R40.1 9.95,9.11 9.69,9.37
I_ABC_GEN_WET
  Top 0.305: R47.1 98.47,23.03 IC2.8 99.91,24.66 R6.2 99.82,25.49 99.82,26.67 97.28,29.21 R34.1 R35.1
I_ABC_WET
  Top 0.305: IC7.1 90.49,22.12 R25.2
MIX_CV_IN
  Top 0.305: X1.4 51.65,34.25 52.45,35.05 98.3,35.05 102.23,31.11 R5.1
N$1
  Top 1.016: SV1.1 24.13,34.29 D2.C
  Bottom 1.016: SV1.1 SV1.2
N$2
  Top 0.305: 72.17,16.51 67.31,16.51 66.64,17.18 IC1.13 66.64,20.31 66,20.95 66,22.61 R1.1 66.22,22.9 C25.1 | R3.2 72.17,16.51 | 72.17,16.51 R2.2
N$7
  Top 0.305: RV5.2 95.23,1.27 100.33,1.27 102.23,3.17 R4.1
N$8
  Top 0.305: IC6.10 IC6.9
N$9
  Top 0.305: IC7.15 84.45,17.12 84.9,17.57 R30.2
N$10
  Top 0.305: IC7.5 80.64,25.53 79.5,26.67 74.42,26.67 71.25,23.5 R17.1 70.83,23.07 69.25,21.49 IC1.9
N$12
  Top 0.305: IC7.2 84.45,24.55 R29.2
N$13
  Top 0.305: IC1.6 69.25,10.64 69.94,9.95 R16.1 71.54,9.65 76.33,9.65 80.64,13.97 IC7.12
N$14
  Top 0.305: IC1.8 69.89,20.02 R17.2 71.54,21.38 72.07,21.91 C23.1
N$15
  Top 1.016: D1.A SV1.10
  Bottom 1.016: SV1.9 SV1.10
N$18
  Top 0.305: R6.1 97.82,25.01 IC2.9 97.82,21.56 99.06,20.32 102.23,20.32 | R4.2 102.23,20.32 | 102.23,20.32 R5.2
N$20
  Top 0.305: IC1.7 69.89,13 R16.2 71.54,11.64 72.07,11.12 C21.1
N$23
  Top 0.305: IC7.3 R20.2 R53.2
N$24
  Top 0.305: IC7.4 R52.2
N$26
  Top 0.305: IC2.13 95.22,25.01 R18.1 R21.2 94.58,27.56 94.58,29.03 R34.2 92.71,29.21 91.44,27.94 JP1.1
N$27
  Top 0.305: R47.2 99.91,19.05 98.42,19.05 97.82,18.45 IC2.6 97.82,15.63 R38.1 R39.2
N$28
  Top 0.305: R25.1 93.13,23.07 R18.2 93.13,24.66 IC2.14
N$31
  Top 0.305: IC2.1 93.13,15.98 R22.2 93.13,16.94 R26.1
N$32
  Top 0.305: IC2.2 95.22,15.63 R22.1 94.83,15.04 R23.2 | R23.2 93.13,12.53 94.23,11.43 R33.2 | R23.2 90.81,13.34 JP2.1
N$33
  Top 0.305: IC7.14 R51.2
N$34
  Top 0.305: IC7.13 81.92,13.46 79.38,10.92 R19.2 R50.2
N$35
  Top 0.305: IC6.7 IC6.8
N$36
  Top 0.305: R3.1 73.88,13.23 C21.2
N$37
  Top 0.305: IC6.15 48.9,13.36 45.91,10.38 R31.2
N$38
  Top 0.305: R2.1 73.88,19.79 C23.2
N$39
  Top 0.305: IC7.10 IC7.9
N$40
  Top 0.305: IC6.12 52.7,16.76 53.85,17.91 55.24,17.91 56.09,18.76 R63.1 57.62,21.21 58.42,21.21 58.84,21.63 58.84,22.43 58.45,22.83 IC4.9
N$41
  Top 0.305: IC4.6 IC4.7
N$42
  Top 0.305: C17.2 61.59,19.24 61.59,24.77 60.54,25.82 R44.2 59.8,25.71 58.87,24.78 IC4.12
N$43
  Top 0.305: IC7.7 IC7.8
N$44
  Top 0.305: R9.1 66.04,11.77 66.64,12.38 IC1.2 66.64,15.78 63.5,18.92 63.5,25.65 66.04,28.19 R8.2 R7.2
N$45
  Top 0.305: RV3.1 46.69,2.79 41.91,2.79 40.64,4.06 R54.2
N$46
  Top 0.305: IC6.14 50.16,15.88 49.53,16.51 R48.2
N$48
  Top 0.305: IC6.13 R49.2 51.44,13.12 52.49,12.06 R24.2
N$49
  Top 0.305: RV3.3 59.4,5.5 R55.1
N$50
  Top 0.305: RV1.2 13.4,5.5 R11.1
N$51
  Top 0.305: IC3.6 8.01,10.13 R13.1 7.07,9.74 6.1,8.76 6.1,6.99 6.86,6.22 12.45,6.22 13.42,7.2 R11.2 16.17,7.2 17.02,6.35 R12.2
N$52
  Top 0.305: R40.2 12.32,8.29 12.32,11.81 11.4,12.73 IC3.2 8.01,12.73 R65.1 7.2,13.12 6.35,13.97 R64.2
N$53
  Top 0.305: R65.2 8.36,14.82 9.05,14.13 | 9.05,14.13 IC3.1 | R27.1 9.05,15.23 9.05,14.13
N$54
  Top 0.305: IC3.12 14.59,12.08 14.22,12.45 14.22,13.97 14.82,14.57 R56.2
N$55
  Top 0.305: IC3.13 17.39,12.73 R59.1 19.43,13.12 19.85,12.7 R61.2
N$56
  Top 0.305: IC3.14 17.04,14.82 R59.2 17.78,16.32 C24.1
N$57
  Top 0.305: R10.1 44.2,4.23 45.09,5.12 50.76,5.12 52.2,3.68 RV3.2
N$58
  Top 0.305: IC3.9 17.39,10.13 R14.1 19.47,9.74 21.59,7.62 27.81,7.62 30.23,5.21 38.1,5.21 39.2,6.31 42.8,6.31 R10.2 43.6,6.35 R15.2
N$59
  Top 0.305: Q1.1 40.92,12.7 C18.2 | C18.2 42.23,11.49 42.76,10.96 R60.1 | C18.2 42.23,13.78 42.76,14.31 R62.2
N$60
  Top 0.305: D4.A 29.82,11.05 31.69,11.05 C19.2 32.07,9.62 R57.2
N$61
  Top 0.305: D3.A 29.64,14.73 31.56,14.73 C22.2 32.07,13.44 R58.2
N$64
  Top 0.305: Q1.3 36.98,11.8 R37.1 36.03,11.64 35.81,11.43 C19.1 | C19.1 33.97,13.23 R58.1 | C19.1 33.97,9.62 R57.1
N$67
  Top 0.305: Q1.2 36.98,13.6 R36.2 36.09,13.76 34.6,15.24 C22.1
N$68
  Top 0.305: R32.2 91.86,9.53 90.17,11.21 JP2.2
N$69
  Top 0.305: D3.C 26.25,14.6 R61.1 26.25,10.8 D4.C
N$70
  Top 0.305: IC5.13 43.08,24.16 43.56,24.64 43.56,26.54 43.43,26.67 | 43.43,26.67 43.31,26.67 R41.1 | R42.2 43.43,26.67
N$73
  Top 0.305: IC5.6 35.23,21.56 32.72,19.05 D6.C 31.28,19.05 29.84,20.49 R66.1
N$75
  Top 0.305: R41.2 41.06,26.04 42.27,24.82 IC5.14 40.56,24.81 37.96,22.21 IC5.5
N$77
  Top 0.305: R35.2 92.08,31.11 91.44,30.48 JP1.2
N$82
  Top 0.305: 38.97,21.56 38.97,21.82 40.66,23.51 IC5.12 43.32,23.51 44.58,24.77 R43.2 | IC5.9 38.97,21.56 | D5.C 38.97,19.14 38.97,21.56
N$83
  Top 0.305: IC5.8 42.27,19.12 D5.A
N$84
  Top 0.305: IC5.3 35.23,23.51 C20.1 31.21,25.09 R28.2 30.73,25.18 29.84,24.3 R66.2
N$85
  Top 0.305: IC5.7 34.72,19.16 D6.A
N$86
  Top 0.305: IC4.2 50.77,25.43 49.53,26.67 R45.2 51.01,27.09 R46.1
N$87
  Top 0.305: R12.1 27.56,6.35 30.61,3.3 RV2.2
N$88
  Top 0.305: RV4.2 72.48,3.3 70.32,5.46 63.97,5.46 R15.1
VAC_B_CV
  Top 0.305: R14.2 17.04,8.04 IC3.8 14.4,9.48 13.12,10.76 R56.1
WET  (via drill 0.4)
  Top 0.305: v21.72,16.64 21.59,16.51 C24.2 | v23.24,18.16 23.37,18.03 43.43,18.03 46.99,21.59 53.34,21.59 54.23,22.48 54.23,24.93 60.54,31.24 60.54,33.78 60.96,34.29 80.01,34.29 83.19,31.11 R20.1
  Bottom 0.305: v21.72,16.64 v23.24,18.16

### Text on the board
tPlace: cicely B v1.0 | (c) 2022 expert sleepers | -12V